# Altium project Ambilight.PrjPcb
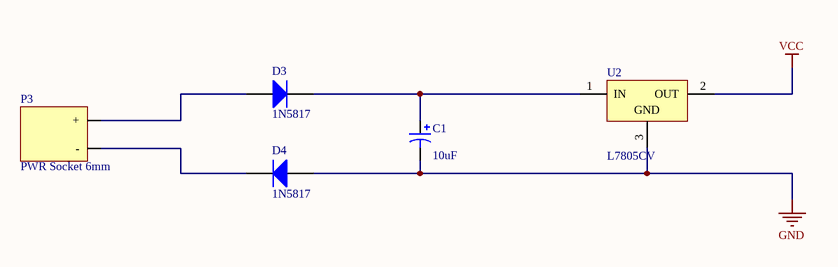
[diagram p0: Power.SchDoc]
7 sheets, 56 parts. Net scope: flat (ports and power ports of the same name join across sheets).
Board files: Interface Board.PcbDoc, LED Control Board.PcbDoc
Sheets:
  Power.SchDoc
  Reset.SchDoc
  USB Circuit.SchDoc
  LED Circuit.SchDoc
  LED Control A0-A3.SchDoc
  LED Control A4-A7.SchDoc
  LED Connectors.SchDoc

## Sheet Power.SchDoc
size A4

### Parts
C1  value 10uF  [CAPPR1.5-4x5]  (hidden comment: Cap Pol1)
D3  1N5817  [1N5817]
D4  1N5817  [1N5817]
P3  PWR Socket 6mm  [PWR Socket 6mm]
U2  L7805CV  [TO220ABN]

### Nets
GND: C1.2 D4.A U2.3(GND)
VCC: U2.2(OUT)
NetC1_1: C1.1 D3.K U2.1(IN)
NetD3_A: D3.A P3.+
NetD4_K: D4.K P3.-

### Library data of the parts
C1 = Cap Pol1: Polarized Capacitor (Radial); Published: 8-Jun-2000; LatestRevisionDate: 17-Jul-2002; LatestRevisionNote: Re-released for DXP Platform.; PackageReference: RB7.6-15; Publisher: Altium Limited
U2 = L7805CV: Positive Voltage Regulator; Note: Tab is connected to pin 3 (GND).; Published: 24-Aug-2001; LatestRevisionDate: 17-Jul-2002; LatestRevisionNote: Re-released for DXP Platform.; DatasheetVersion: Dec-1998; PackageVersion: Jun-1998; PackageReference: TO220ABN; Publisher: Altium Limited; PackageDescription: TO, Thru-Hole, Vertical, Heatsink Mounted; 3 In-Line Leads; Pitch 2.54 mm; Pin sequence 1, 3, 2; ComponentLink1Description: Manufacturer Link; ComponentLink1URL: http://www.st.com/

## Sheet Reset.SchDoc
size A4
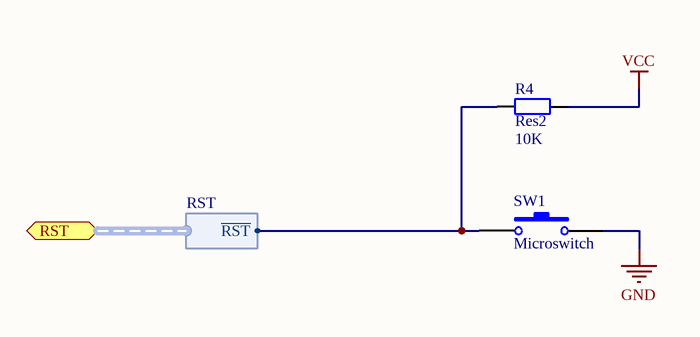
[diagram p1: Reset.SchDoc]

### Parts
R4  Res2  value 10K  [AXIAL-0.4]
SW1  Microswitch  [DIP Microswitch 6x6mm]

### Ports
RST (harness RST)

### Harnesses
RST: ~{RST}

### Nets
GND: SW1.2
VCC: R4.2
NetP4_2: R4.1 SW1.1 ; port RST.~{RST}

### Library data of the parts
R4 = Res2: Resistor; Published: 8-Jun-2000; LatestRevisionDate: 17-Jul-2002; LatestRevisionNote: Re-released for DXP Platform.; PackageReference: AXIAL-0.4; Publisher: Altium Limited

## Sheet USB Circuit.SchDoc
size A4
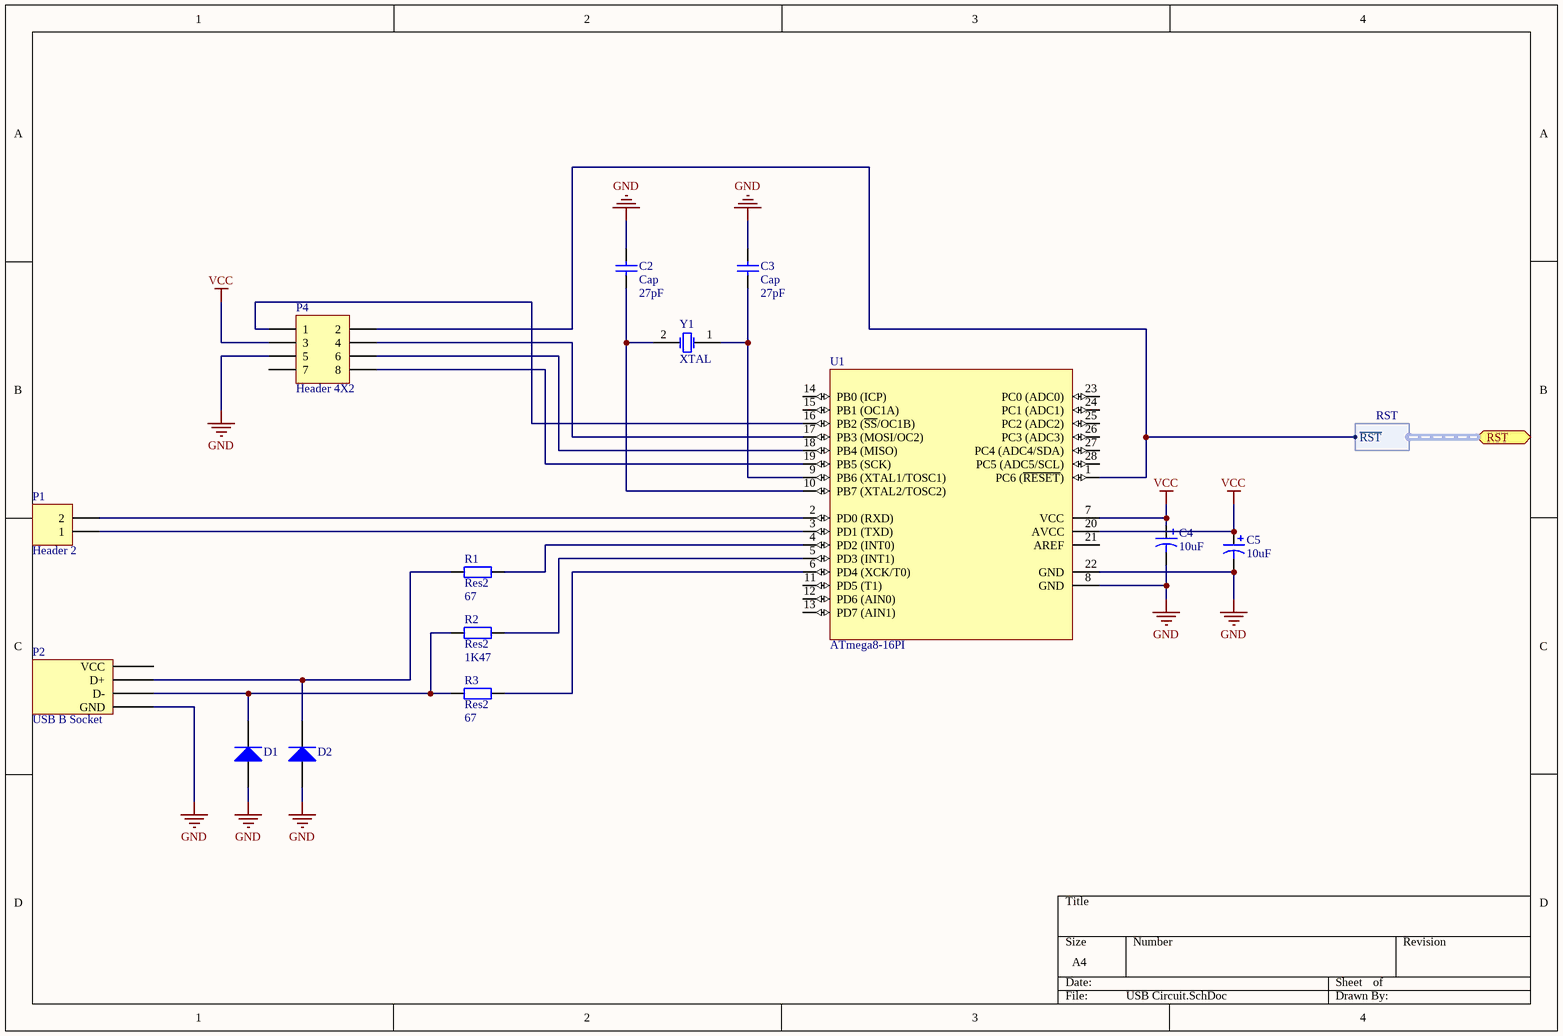
[diagram p2: USB Circuit.SchDoc]

### Parts
C2  Cap  value 27pF  [CAPR2.54-5.1x3.2]
C3  Cap  value 27pF  [CAPR2.54-5.1x3.2]
C4  value 10uF  [CAPPR1.5-4x5]  (hidden comment: Cap Pol1)
C5  value 10uF  [CAPPR1.5-4x5]  (hidden comment: Cap Pol1)
D1  BZX79-C3V6  [SOD27]  (value not drawn)
D2  BZX79-C3V6  [SOD27]  (value not drawn)
P1  Header 2  [HDR1X2]
P2  USB B Socket  [USB B Socket]
P4  Header 4X2  [HDR2X4]
R1  Res2  value 67  [AXIAL-0.4]
R2  Res2  value 1K47  [AXIAL-0.4]
R3  Res2  value 67  [AXIAL-0.4]
U1  ATmega8-16PI  [28P3]
Y1  XTAL  [Crystal Oscillator]

### Ports
RST (harness RST)

### Harnesses
RST: ~{RST}

### Nets
GND: C2.2 C3.2 C4.2 C5.2 D1.1(A) D2.1(A) P2.GND P4.5 U1.8(GND) U1.22(GND)
VCC: C4.1 C5.1 P4.3 U1.7(VCC) U1.20(AVCC)
NetC2_1: C2.1 U1.10(PB7_(XTAL2/TOSC2)) Y1.2(OSC2)
NetC3_1: C3.1 U1.9(PB6_(XTAL1/TOSC1)) Y1.1(OSC1)
NetD1_2: D1.2(K) P2.D- R2.2 R3.1
NetD2_2: D2.2(K) P2.D+ R1.1
NetP1_1: P1.1 U1.3(PD1_(TXD))
NetP1_2: P1.2 U1.2(PD0_(RXD))
NetP4_1: P4.1 U1.16(PB2_(~{SS}/OC1B))
NetP4_2: P4.2 U1.1(PC6_(~{RESET})) ; port RST.~{RST}
NetP4_4: P4.4 U1.17(PB3_(MOSI/OC2))
NetP4_6: P4.6 U1.18(PB4_(MISO))
NetP4_8: P4.8 U1.19(PB5_(SCK))
NetR1_2: R1.2 U1.4(PD2_(INT0))
NetR2_1: R2.1 U1.5(PD3_(INT1))
NetR3_2: R3.2 U1.6(PD4_(XCK/T0))

Not connected (* = marked no-connect by the designer): P2 VCC; P4 7; U1 11(PD5_(T1)) 12(PD6_(AIN0)) 13(PD7_(AIN1)) 14(PB0_(ICP)) 15(PB1_(OC1A)) 21(AREF) 23(PC0_(ADC0)) 24(PC1_(ADC1)) 25(PC2_(ADC2)) 26(PC3_(ADC3)) 27(PC4_(ADC4/SDA)) 28(PC5_(ADC5/SCL))

### Library data of the parts
C2 C3 = Cap: Capacitor; Published: 8-Jun-2000; LatestRevisionDate: 17-Jul-2002; LatestRevisionNote: Re-released for DXP Platform.; PackageReference: RAD-0.3; Publisher: Altium Limited
C4 C5 = Cap Pol1: Polarized Capacitor (Radial); Published: 8-Jun-2000; LatestRevisionDate: 17-Jul-2002; LatestRevisionNote: Re-released for DXP Platform.; PackageReference: RB7.6-15; Publisher: Altium Limited
D1 D2 = BZX79-C3V6: Voltage Regulator Diode; Code_IEC: A24; Published: 17-Sep-2003; DatasheetVersion: 27-Feb-2002; PackageVersion: Apr-1999; PackageReference: SOD27; Publisher: Altium Limited; PackageDescription: Diode, Axial; Body 4.3 x 1.9 mm (LxDia. max), Lead Dia. 0.56 mm (max); Code_JEITA: SC-40; Code_JEDEC: DO-35; ComponentLink1Description: Manufacturer Link; ComponentLink1URL: http://www.semiconductors.philips.com/; ComponentLink2Description: Datasheet; ComponentLink2URL: http://www.semiconductors.philips.com/acrobat/datasheets/BZX79_3.pdf
P1 = Header 2: Header, 2-Pin; LatestRevisionDate: 17-Jul-2002; LatestRevisionNote: Re-released for DXP Platform.; Publisher: Altium Limited
P4 = Header 4X2: Header, 4-Pin, Dual row; LatestRevisionDate: 17-Jul-2002; LatestRevisionNote: Re-released for DXP Platform.; Publisher: Altium Limited
R1-R3 = Res2: Resistor; Published: 8-Jun-2000; LatestRevisionDate: 17-Jul-2002; LatestRevisionNote: Re-released for DXP Platform.; PackageReference: AXIAL-0.4; Publisher: Altium Limited
U1 = ATmega8-16PI: 8-Bit AVR Microcontroller with 8K Bytes of In-System Programmable Flash Memory; Published: 17-Sep-2003; LatestRevisionDate: 04-Mar-2005; LatestRevisionNote: Stylized 3D Model Added.; DatasheetVersion: 2486H-AVR-09/02; PackageVersion: revB, Sep-2001; PackageReference: 28P3; Publisher: Altium Limited; PackageDescription: DIP; 28 Leads; Row Spacing 7.62 mm; Pitch 2.54 mm; ComponentLink1Description: Manufacturer Link; ComponentLink1URL: http://www.atmel.com; ComponentLink2Description: Datasheet; ComponentLink2URL: http://www.atmel.com/dyn/resources/prod_documents/doc2486.pdf
Y1 = Crystal Oscillator

## Sheet LED Circuit.SchDoc
size A4
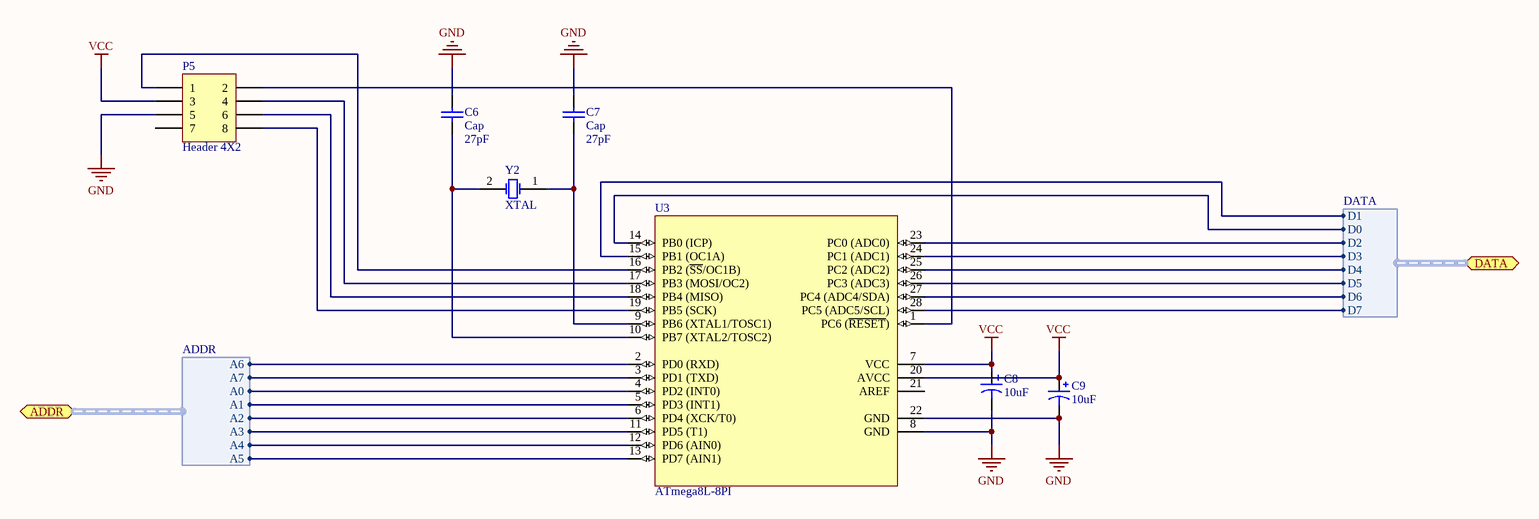
[diagram p3: LED Circuit.SchDoc]

### Parts
C6  Cap  value 27pF  [CAPR2.54-5.1x3.2]
C7  Cap  value 27pF  [CAPR2.54-5.1x3.2]
C8  value 10uF  [CAPPR1.5-4x5]  (hidden comment: Cap Pol1)
C9  value 10uF  [CAPPR1.5-4x5]  (hidden comment: Cap Pol1)
P5  Header 4X2  [HDR2X4]
U3  ATmega8L-8PI  [28P3]
Y2  XTAL  [Crystal Oscillator]

### Ports
ADDR (harness ADDR), DATA (harness DATA)

### Harnesses
ADDR: A6, A7, A0, A1, A2, A3, A4, A5
DATA: D1, D0, D2, D3, D4, D5, D6, D7

### Nets
GND: C6.2 C7.2 C8.2 C9.2 P5.5 U3.8(GND) U3.22(GND)
VCC: C8.1 C9.1 P5.3 U3.7(VCC) U3.20(AVCC)
NetC6_1: C6.1 U3.10(PB7_(XTAL2/TOSC2)) Y2.2(OSC2)
NetC7_1: C7.1 U3.9(PB6_(XTAL1/TOSC1)) Y2.1(OSC1)
NetP5_1: P5.1 U3.16(PB2_(~{SS}/OC1B))
NetP5_2: P5.2 U3.1(PC6_(~{RESET}))
NetP5_4: P5.4 U3.17(PB3_(MOSI/OC2))
NetP5_6: P5.6 U3.18(PB4_(MISO))
NetP5_8: P5.8 U3.19(PB5_(SCK))
NetU3_2: U3.2(PD0_(RXD)) ; port ADDR.A6
NetU3_3: U3.3(PD1_(TXD)) ; port ADDR.A7
NetU3_4: U3.4(PD2_(INT0)) ; port ADDR.A0
NetU3_5: U3.5(PD3_(INT1)) ; port ADDR.A1
NetU3_6: U3.6(PD4_(XCK/T0)) ; port ADDR.A2
NetU3_11: U3.11(PD5_(T1)) ; port ADDR.A3
NetU3_12: U3.12(PD6_(AIN0)) ; port ADDR.A4
NetU3_13: U3.13(PD7_(AIN1)) ; port ADDR.A5
NetU3_14: U3.14(PB0_(ICP)) ; port DATA.D0
NetU3_15: U3.15(PB1_(OC1A)) ; port DATA.D1
NetU3_23: U3.23(PC0_(ADC0)) ; port DATA.D2
NetU3_24: U3.24(PC1_(ADC1)) ; port DATA.D3
NetU3_25: U3.25(PC2_(ADC2)) ; port DATA.D4
NetU3_26: U3.26(PC3_(ADC3)) ; port DATA.D5
NetU3_27: U3.27(PC4_(ADC4/SDA)) ; port DATA.D6
NetU3_28: U3.28(PC5_(ADC5/SCL)) ; port DATA.D7

Not connected (* = marked no-connect by the designer): P5 7; U3 21(AREF)

### Library data of the parts
C6 C7 = Cap: Capacitor; Published: 8-Jun-2000; LatestRevisionDate: 17-Jul-2002; LatestRevisionNote: Re-released for DXP Platform.; PackageReference: RAD-0.3; Publisher: Altium Limited
C8 C9 = Cap Pol1: Polarized Capacitor (Radial); Published: 8-Jun-2000; LatestRevisionDate: 17-Jul-2002; LatestRevisionNote: Re-released for DXP Platform.; PackageReference: RB7.6-15; Publisher: Altium Limited
P5 = Header 4X2: Header, 4-Pin, Dual row; LatestRevisionDate: 17-Jul-2002; LatestRevisionNote: Re-released for DXP Platform.; Publisher: Altium Limited
U3 = ATmega8L-8PI: 8-Bit AVR Microcontroller with 8K Bytes of In-System Programmable Flash Memory; Published: 17-Sep-2003; LatestRevisionDate: 04-Mar-2005; LatestRevisionNote: Stylized 3D Model Added.; DatasheetVersion: 2486H-AVR-09/02; PackageVersion: revB, Sep-2001; PackageReference: 28P3; Publisher: Altium Limited; PackageDescription: DIP; 28 Leads; Row Spacing 7.62 mm; Pitch 2.54 mm; ComponentLink1Description: Manufacturer Link; ComponentLink1URL: http://www.atmel.com; ComponentLink2Description: Datasheet; ComponentLink2URL: http://www.atmel.com/dyn/resources/prod_documents/doc2486.pdf
Y2 = Crystal Oscillator

## Sheet LED Control A0-A3.SchDoc
size A4; Author: Karol Maciaszek
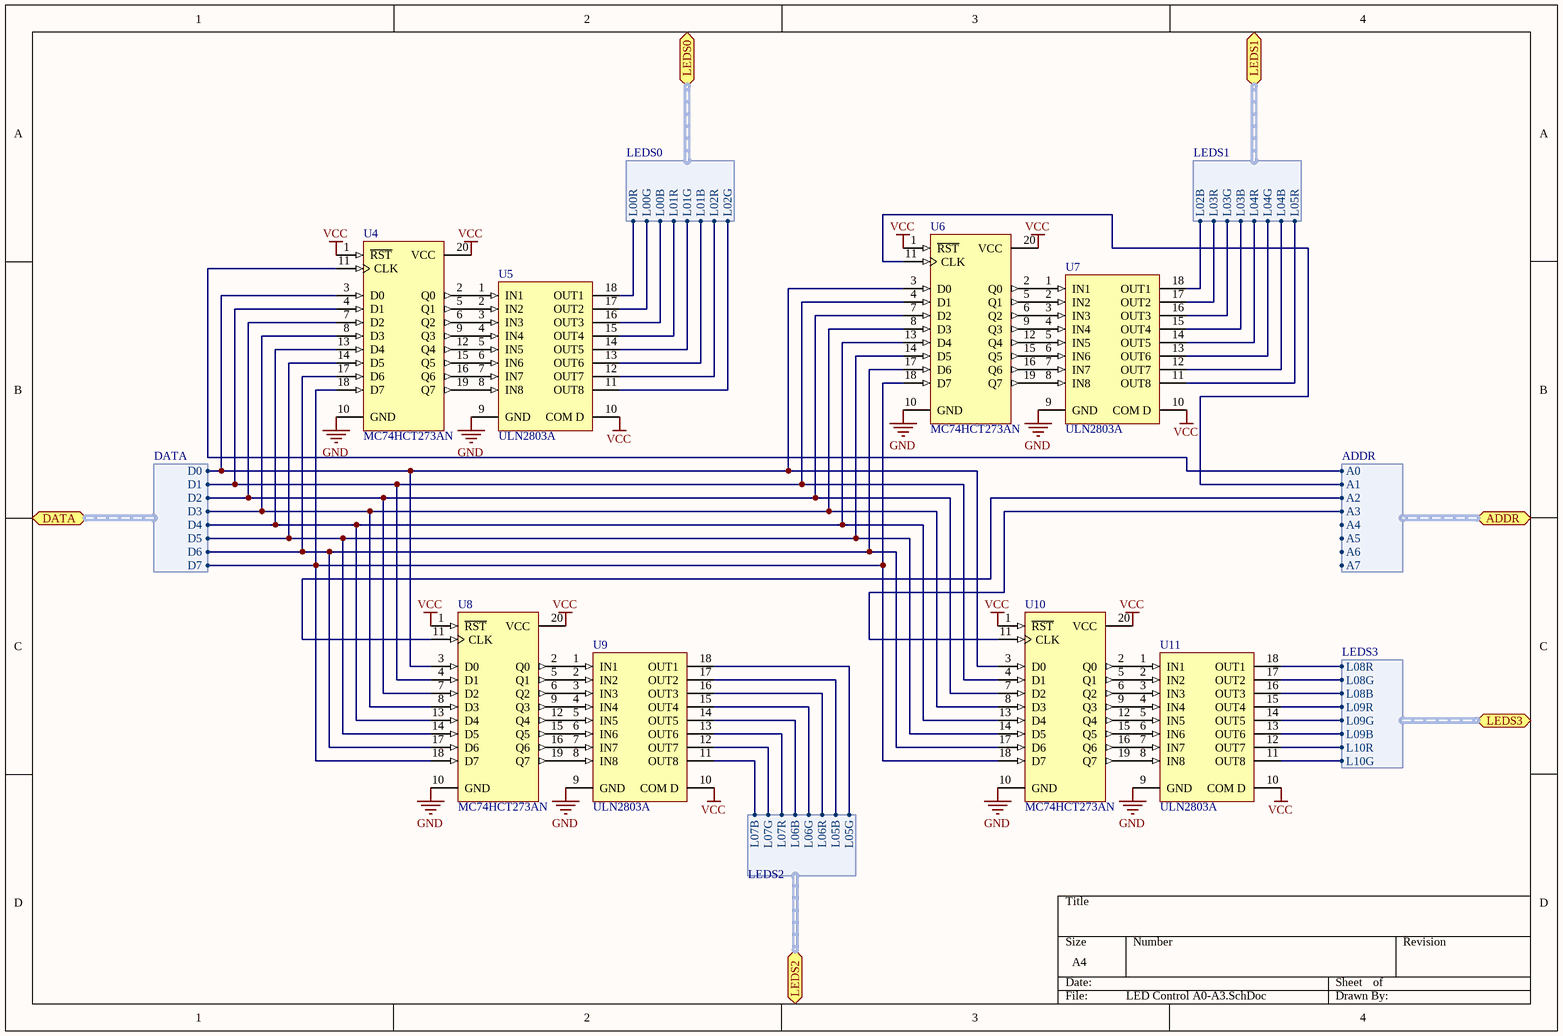
[diagram p4: LED Control A0-A3.SchDoc]

### Parts
U4  MC74HCT273AN  [738-03]
U5  ULN2803A  [DIP18]
U6  MC74HCT273AN  [738-03]
U7  ULN2803A  [DIP18]
U8  MC74HCT273AN  [738-03]
U9  ULN2803A  [DIP18]
U10  MC74HCT273AN  [738-03]
U11  ULN2803A  [DIP18]

### Ports
ADDR (harness ADDR), DATA (harness DATA), LEDS0 (harness LEDS0), LEDS1 (harness LEDS1), LEDS2 (harness LEDS2), LEDS3 (harness LEDS3)

### Harnesses
DATA: D7, D6, D5, D4, D3, D2, D1, D0
ADDR: A7, A6, A5, A4, A3, A2, A1, A0
LEDS0: L00R, L00G, L00B, L01R, L01G, L01B, L02R, L02G
LEDS1: L02B, L03R, L03G, L03B, L04R, L04G, L04B, L05R
LEDS2: L05G, L05B, L06R, L06G, L06B, L07R, L07G, L07B
LEDS3: L08R, L08G, L08B, L09R, L09G, L09B, L10R, L10G

### Nets
GND: U4.10(GND) U5.9(GND) U6.10(GND) U7.9(GND) U8.10(GND) U9.9(GND) U10.10(GND) U11.9(GND)
VCC: U4.1(~{RST}) U4.20(VCC) U5.10(COM_D) U6.1(~{RST}) U6.20(VCC) U7.10(COM_D) U8.1(~{RST}) U8.20(VCC) U9.10(COM_D) U10.1(~{RST}) U10.20(VCC) U11.10(COM_D)
NetPL00_1: U5.18(OUT1) ; port LEDS0.L00R
NetPL00_2: U5.17(OUT2) ; port LEDS0.L00G
NetPL00_3: U5.16(OUT3) ; port LEDS0.L00B
NetPL01_1: U5.15(OUT4) ; port LEDS0.L01R
NetPL01_2: U5.14(OUT5) ; port LEDS0.L01G
NetPL01_3: U5.13(OUT6) ; port LEDS0.L01B
NetPL02_1: U5.12(OUT7) ; port LEDS0.L02R
NetPL02_2: U5.11(OUT8) ; port LEDS0.L02G
NetPL02_3: U7.18(OUT1) ; port LEDS1.L02B
NetPL03_1: U7.16(OUT3) ; port LEDS1.L03G
NetPL03_2: U7.17(OUT2) ; port LEDS1.L03R
NetPL03_3: U7.15(OUT4) ; port LEDS1.L03B
NetPL04_1: U7.14(OUT5) ; port LEDS1.L04R
NetPL04_2: U7.13(OUT6) ; port LEDS1.L04G
NetPL04_3: U7.12(OUT7) ; port LEDS1.L04B
NetPL05_1: U7.11(OUT8) ; port LEDS1.L05R
NetPL05_2: U9.18(OUT1) ; port LEDS2.L05G
NetPL05_3: U9.17(OUT2) ; port LEDS2.L05B
NetPL06_1: U9.16(OUT3) ; port LEDS2.L06R
NetPL06_2: U9.15(OUT4) ; port LEDS2.L06G
NetPL06_3: U9.14(OUT5) ; port LEDS2.L06B
NetPL07_1: U9.13(OUT6) ; port LEDS2.L07R
NetPL07_2: U9.12(OUT7) ; port LEDS2.L07G
NetPL07_3: U9.11(OUT8) ; port LEDS2.L07B
NetPL08_1: U11.18(OUT1) ; port LEDS3.L08R
NetPL08_2: U11.17(OUT2) ; port LEDS3.L08G
NetPL08_3: U11.16(OUT3) ; port LEDS3.L08B
NetPL09_1: U11.15(OUT4) ; port LEDS3.L09R
NetPL09_2: U11.14(OUT5) ; port LEDS3.L09G
NetPL09_3: U11.13(OUT6) ; port LEDS3.L09B
NetPL10_1: U11.12(OUT7) ; port LEDS3.L10R
NetPL10_2: U11.11(OUT8) ; port LEDS3.L10G
NetU3_4: U4.11(CLK) ; port ADDR.A0
NetU3_5: U6.11(CLK) ; port ADDR.A1
NetU3_6: U8.11(CLK) ; port ADDR.A2
NetU3_11: U10.11(CLK) ; port ADDR.A3
NetU3_14: U4.3(D0) U6.3(D0) U8.3(D0) U10.3(D0) ; port DATA.D0
NetU3_15: U4.4(D1) U6.4(D1) U8.4(D1) U10.4(D1) ; port DATA.D1
NetU3_23: U4.7(D2) U6.7(D2) U8.7(D2) U10.7(D2) ; port DATA.D2
NetU3_24: U4.8(D3) U6.8(D3) U8.8(D3) U10.8(D3) ; port DATA.D3
NetU3_25: U4.13(D4) U6.13(D4) U8.13(D4) U10.13(D4) ; port DATA.D4
NetU3_26: U4.14(D5) U6.14(D5) U8.14(D5) U10.14(D5) ; port DATA.D5
NetU3_27: U4.17(D6) U6.17(D6) U8.17(D6) U10.17(D6) ; port DATA.D6
NetU3_28: U4.18(D7) U6.18(D7) U8.18(D7) U10.18(D7) ; port DATA.D7
NetU4_2: U4.2(Q0) U5.1(IN1)
NetU4_5: U4.5(Q1) U5.2(IN2)
NetU4_6: U4.6(Q2) U5.3(IN3)
NetU4_9: U4.9(Q3) U5.4(IN4)
NetU4_12: U4.12(Q4) U5.5(IN5)
NetU4_15: U4.15(Q5) U5.6(IN6)
NetU4_16: U4.16(Q6) U5.7(IN7)
NetU4_19: U4.19(Q7) U5.8(IN8)
NetU6_2: U6.2(Q0) U7.1(IN1)
NetU6_5: U6.5(Q1) U7.2(IN2)
NetU6_6: U6.6(Q2) U7.3(IN3)
NetU6_9: U6.9(Q3) U7.4(IN4)
NetU6_12: U6.12(Q4) U7.5(IN5)
NetU6_15: U6.15(Q5) U7.6(IN6)
NetU6_16: U6.16(Q6) U7.7(IN7)
NetU6_19: U6.19(Q7) U7.8(IN8)
NetU8_2: U8.2(Q0) U9.1(IN1)
NetU8_5: U8.5(Q1) U9.2(IN2)
NetU8_6: U8.6(Q2) U9.3(IN3)
NetU8_9: U8.9(Q3) U9.4(IN4)
NetU8_12: U8.12(Q4) U9.5(IN5)
NetU8_15: U8.15(Q5) U9.6(IN6)
NetU8_16: U8.16(Q6) U9.7(IN7)
NetU8_19: U8.19(Q7) U9.8(IN8)
NetU10_2: U10.2(Q0) U11.1(IN1)
NetU10_5: U10.5(Q1) U11.2(IN2)
NetU10_6: U10.6(Q2) U11.3(IN3)
NetU10_9: U10.9(Q3) U11.4(IN4)
NetU10_12: U10.12(Q4) U11.5(IN5)
NetU10_15: U10.15(Q5) U11.6(IN6)
NetU10_16: U10.16(Q6) U11.7(IN7)
NetU10_19: U10.19(Q7) U11.8(IN8)

### Library data of the parts
U4 U6 U8 U10 = MC74HCT273AN: Octal D-Type Flip-Flop with Common Clock and Reset with LSTTL-Compatible Inputs; Published: 15-Apr-2002; DatasheetVersion: Mar-2000; PackageVersion: 1996; PackageReference: 738-03; Publisher: Altium Limited; PackageDescription: DIP; 20 Leads; Row Spacing 7.62 mm; Pitch 2.54 mm; Code_JEDEC: MS-001-AD; ComponentLink1Description: Manufacturer Link; ComponentLink1URL: http://www.onsemi.com/; ComponentLink2Description: Datasheet; ComponentLink2URL: http://www.onsemi.com/pub/Collateral/MC74HCT273A-D.PDF
U5 U7 U9 U11 = ULN2803A: Eight Darlington Array; Published: 8-Jun-2000; LatestRevisionDate: 06-Jun-2005; LatestRevisionNote: Stylized 3D Model Added.; DatasheetVersion: Sep-1997; PackageReference: DIP18; Publisher: Altium Limited; PackageDescription: DIP; 18 Leads; Row Spacing 7.62 mm; Pitch 2.54 mm; ComponentLink1Description: Manufacturer Link; ComponentLink1URL: http://www.st.com/; ComponentLink2Description: Datasheet; ComponentLink2URL: http://www.st.com/stonline/products/literature/ds/1536/uln2801a.pdf

## Sheet LED Control A4-A7.SchDoc
size A4
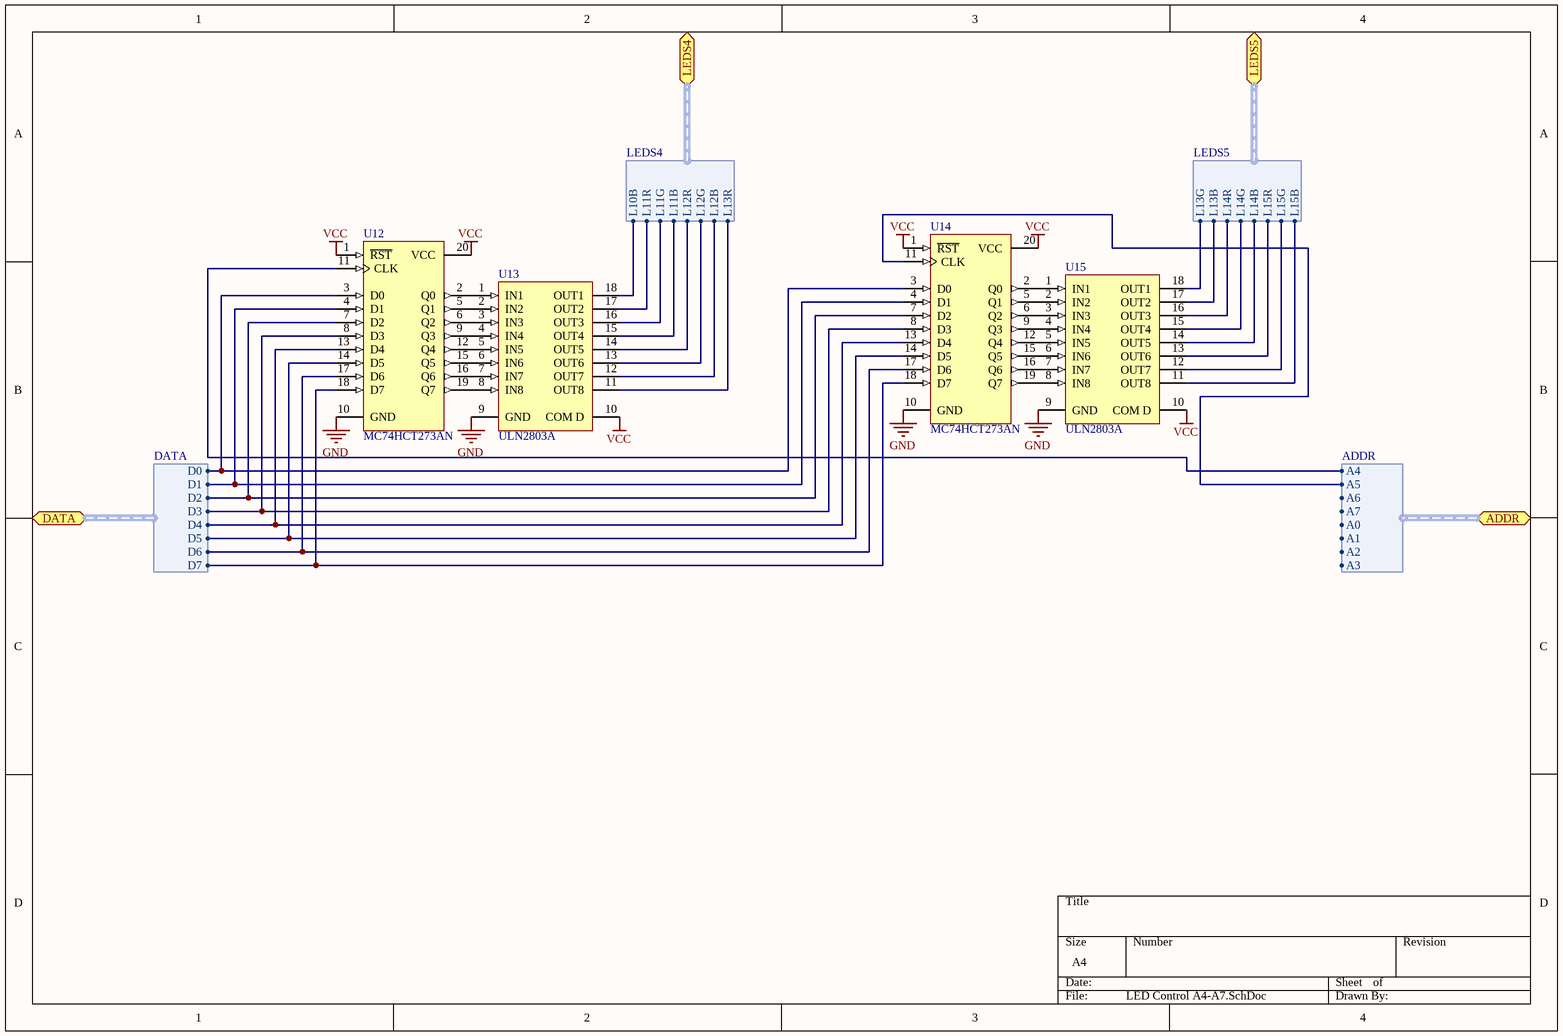
[diagram p5: LED Control A4-A7.SchDoc]

### Parts
U12  MC74HCT273AN  [738-03]
U13  ULN2803A  [DIP18]
U14  MC74HCT273AN  [738-03]
U15  ULN2803A  [DIP18]

### Ports
ADDR (harness ADDR), DATA (harness DATA), LEDS4 (harness LEDS4), LEDS5 (harness LEDS5)

### Harnesses
DATA: D7, D6, D5, D4, D3, D2, D1, D0
LEDS4: L10B, L11R, L11G, L11B, L12R, L12G, L12B, L13R
LEDS5: L13G, L13B, L14R, L14G, L14B, L15R, L15G, L15B
ADDR: A7, A6, A5, A4, A0, A1, A2, A3

### Nets
GND: U12.10(GND) U13.9(GND) U14.10(GND) U15.9(GND)
VCC: U12.1(~{RST}) U12.20(VCC) U13.10(COM_D) U14.1(~{RST}) U14.20(VCC) U15.10(COM_D)
NetPL10_3: U13.18(OUT1) ; port LEDS4.L10B
NetPL11_1: U13.16(OUT3) ; port LEDS4.L11G
NetPL11_2: U13.17(OUT2) ; port LEDS4.L11R
NetPL11_3: U13.15(OUT4) ; port LEDS4.L11B
NetPL12_1: U13.14(OUT5) ; port LEDS4.L12R
NetPL12_2: U13.13(OUT6) ; port LEDS4.L12G
NetPL12_3: U13.12(OUT7) ; port LEDS4.L12B
NetPL13_1: U13.11(OUT8) ; port LEDS4.L13R
NetPL13_2: U15.18(OUT1) ; port LEDS5.L13G
NetPL13_3: U15.17(OUT2) ; port LEDS5.L13B
NetPL14_1: U15.16(OUT3) ; port LEDS5.L14R
NetPL14_2: U15.15(OUT4) ; port LEDS5.L14G
NetPL14_3: U15.14(OUT5) ; port LEDS5.L14B
NetPL15_1: U15.13(OUT6) ; port LEDS5.L15R
NetPL15_2: U15.12(OUT7) ; port LEDS5.L15G
NetPL15_3: U15.11(OUT8) ; port LEDS5.L15B
NetU3_12: U12.11(CLK) ; port ADDR.A4
NetU3_13: U14.11(CLK) ; port ADDR.A5
NetU3_14: U12.3(D0) U14.3(D0) ; port DATA.D0
NetU3_15: U12.4(D1) U14.4(D1) ; port DATA.D1
NetU3_23: U12.7(D2) U14.7(D2) ; port DATA.D2
NetU3_24: U12.8(D3) U14.8(D3) ; port DATA.D3
NetU3_25: U12.13(D4) U14.13(D4) ; port DATA.D4
NetU3_26: U12.14(D5) U14.14(D5) ; port DATA.D5
NetU3_27: U12.17(D6) U14.17(D6) ; port DATA.D6
NetU3_28: U12.18(D7) U14.18(D7) ; port DATA.D7
NetU12_2: U12.2(Q0) U13.1(IN1)
NetU12_5: U12.5(Q1) U13.2(IN2)
NetU12_6: U12.6(Q2) U13.3(IN3)
NetU12_9: U12.9(Q3) U13.4(IN4)
NetU12_12: U12.12(Q4) U13.5(IN5)
NetU12_15: U12.15(Q5) U13.6(IN6)
NetU12_16: U12.16(Q6) U13.7(IN7)
NetU12_19: U12.19(Q7) U13.8(IN8)
NetU14_2: U14.2(Q0) U15.1(IN1)
NetU14_5: U14.5(Q1) U15.2(IN2)
NetU14_6: U14.6(Q2) U15.3(IN3)
NetU14_9: U14.9(Q3) U15.4(IN4)
NetU14_12: U14.12(Q4) U15.5(IN5)
NetU14_15: U14.15(Q5) U15.6(IN6)
NetU14_16: U14.16(Q6) U15.7(IN7)
NetU14_19: U14.19(Q7) U15.8(IN8)

### Library data of the parts
U12 U14 = MC74HCT273AN: as U4 on sheet LED Control A0-A3; Published: 15-Apr-2002; DatasheetVersion: Mar-2000; PackageVersion: 1996; PackageReference: 738-03; Publisher: Altium Limited; PackageDescription: DIP; 20 Leads; Row Spacing 7.62 mm; Pitch 2.54 mm; Code_JEDEC: MS-001-AD; ComponentLink1Description: Manufacturer Link; ComponentLink1URL: http://www.onsemi.com/; ComponentLink2Description: Datasheet; ComponentLink2URL: http://www.onsemi.com/pub/Collateral/MC74HCT273A-D.PDF
U13 U15 = ULN2803A: Eight Darlington Array; Published: 8-Jun-2000; LatestRevisionDate: 06-Jun-2005; LatestRevisionNote: Stylized 3D Model Added.; DatasheetVersion: Sep-1997; PackageReference: DIP18; Publisher: Altium Limited; PackageDescription: DIP; 18 Leads; Row Spacing 7.62 mm; Pitch 2.54 mm; ComponentLink1Description: Manufacturer Link; ComponentLink1URL: http://www.st.com/; ComponentLink2Description: Datasheet; ComponentLink2URL: http://www.st.com/stonline/products/literature/ds/1536/uln2801a.pdf

## Sheet LED Connectors.SchDoc
size A4
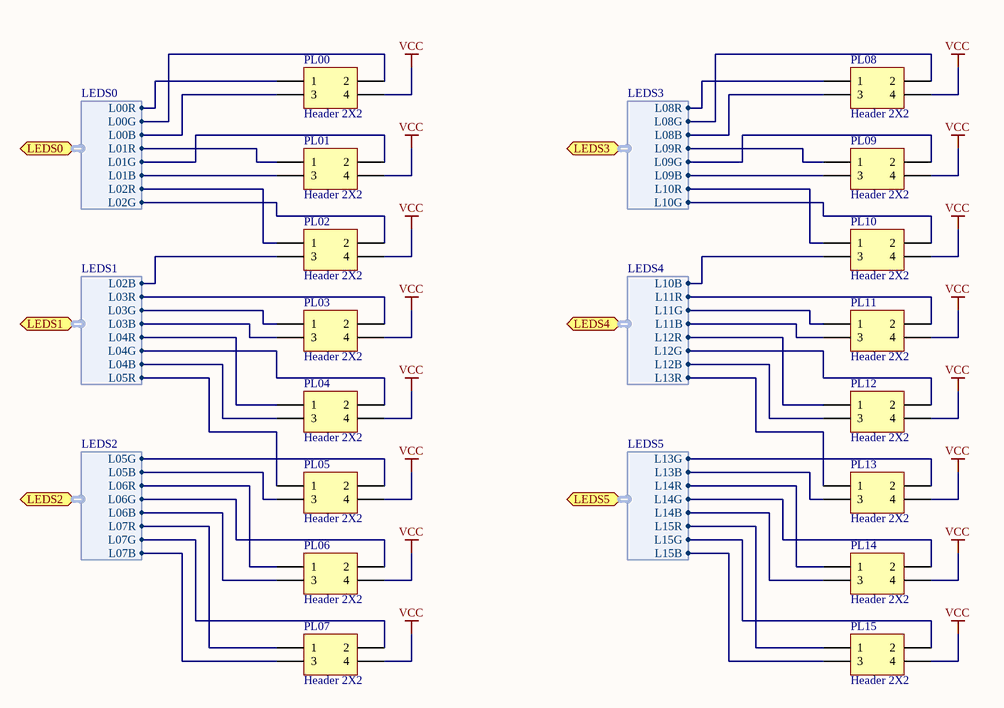
[diagram p6: LED Connectors.SchDoc]

### Parts
PL00  Header 2X2  [HDR2X2]
PL01  Header 2X2  [HDR2X2]
PL02  Header 2X2  [HDR2X2]
PL03  Header 2X2  [HDR2X2]
PL04  Header 2X2  [HDR2X2]
PL05  Header 2X2  [HDR2X2]
PL06  Header 2X2  [HDR2X2]
PL07  Header 2X2  [HDR2X2]
PL08  Header 2X2  [HDR2X2]
PL09  Header 2X2  [HDR2X2]
PL10  Header 2X2  [HDR2X2]
PL11  Header 2X2  [HDR2X2]
PL12  Header 2X2  [HDR2X2]
PL13  Header 2X2  [HDR2X2]
PL14  Header 2X2  [HDR2X2]
PL15  Header 2X2  [HDR2X2]

### Ports
LEDS0 (harness LEDS0), LEDS1 (harness LEDS1), LEDS2 (harness LEDS2), LEDS3 (harness LEDS3), LEDS4 (harness LEDS4), LEDS5 (harness LEDS5)

### Harnesses
LEDS0: L02G, L02R, L01B, L01G, L01R, L00B, L00G, L00R
LEDS1: L05R, L04B, L04G, L04R, L03B, L03G, L03R, L02B
LEDS2: L07B, L07G, L07R, L06B, L06G, L06R, L05B, L05G
LEDS3: L10G, L10R, L09B, L09G, L09R, L08B, L08G, L08R
LEDS4: L13R, L12B, L12G, L12R, L11B, L11G, L11R, L10B
LEDS5: L15B, L15G, L15R, L14B, L14G, L14R, L13B, L13G

### Nets
VCC: PL00.4 PL01.4 PL02.4 PL03.4 PL04.4 PL05.4 PL06.4 PL07.4 PL08.4 PL09.4 PL10.4 PL11.4 PL12.4 PL13.4 PL14.4 PL15.4
NetPL00_1: PL00.1 ; port LEDS0.L00R
NetPL00_2: PL00.2 ; port LEDS0.L00G
NetPL00_3: PL00.3 ; port LEDS0.L00B
NetPL01_1: PL01.1 ; port LEDS0.L01R
NetPL01_2: PL01.2 ; port LEDS0.L01G
NetPL01_3: PL01.3 ; port LEDS0.L01B
NetPL02_1: PL02.1 ; port LEDS0.L02R
NetPL02_2: PL02.2 ; port LEDS0.L02G
NetPL02_3: PL02.3 ; port LEDS1.L02B
NetPL03_1: PL03.1 ; port LEDS1.L03G
NetPL03_2: PL03.2 ; port LEDS1.L03R
NetPL03_3: PL03.3 ; port LEDS1.L03B
NetPL04_1: PL04.1 ; port LEDS1.L04R
NetPL04_2: PL04.2 ; port LEDS1.L04G
NetPL04_3: PL04.3 ; port LEDS1.L04B
NetPL05_1: PL05.1 ; port LEDS1.L05R
NetPL05_2: PL05.2 ; port LEDS2.L05G
NetPL05_3: PL05.3 ; port LEDS2.L05B
NetPL06_1: PL06.1 ; port LEDS2.L06R
NetPL06_2: PL06.2 ; port LEDS2.L06G
NetPL06_3: PL06.3 ; port LEDS2.L06B
NetPL07_1: PL07.1 ; port LEDS2.L07R
NetPL07_2: PL07.2 ; port LEDS2.L07G
NetPL07_3: PL07.3 ; port LEDS2.L07B
NetPL08_1: PL08.1 ; port LEDS3.L08R
NetPL08_2: PL08.2 ; port LEDS3.L08G
NetPL08_3: PL08.3 ; port LEDS3.L08B
NetPL09_1: PL09.1 ; port LEDS3.L09R
NetPL09_2: PL09.2 ; port LEDS3.L09G
NetPL09_3: PL09.3 ; port LEDS3.L09B
NetPL10_1: PL10.1 ; port LEDS3.L10R
NetPL10_2: PL10.2 ; port LEDS3.L10G
NetPL10_3: PL10.3 ; port LEDS4.L10B
NetPL11_1: PL11.1 ; port LEDS4.L11G
NetPL11_2: PL11.2 ; port LEDS4.L11R
NetPL11_3: PL11.3 ; port LEDS4.L11B
NetPL12_1: PL12.1 ; port LEDS4.L12R
NetPL12_2: PL12.2 ; port LEDS4.L12G
NetPL12_3: PL12.3 ; port LEDS4.L12B
NetPL13_1: PL13.1 ; port LEDS4.L13R
NetPL13_2: PL13.2 ; port LEDS5.L13G
NetPL13_3: PL13.3 ; port LEDS5.L13B
NetPL14_1: PL14.1 ; port LEDS5.L14R
NetPL14_2: PL14.2 ; port LEDS5.L14G
NetPL14_3: PL14.3 ; port LEDS5.L14B
NetPL15_1: PL15.1 ; port LEDS5.L15R
NetPL15_2: PL15.2 ; port LEDS5.L15G
NetPL15_3: PL15.3 ; port LEDS5.L15B

### Library data of the parts
PL00 PL01 PL02 PL03 PL04 PL05 PL06 PL07 PL08 PL09-PL15 = Header 2X2: Header, 2-Pin, Dual row; LatestRevisionDate: 17-Jul-2002; LatestRevisionNote: Re-released for DXP Platform.; Publisher: Altium Limited

## Nets that join several sheets
GND: Power (C1.2 D4.A U2.3), Reset (SW1.2), USB Circuit (10 pins), LED Circuit (7 pins), LED Control A0-A3 (8 pins), LED Control A4-A7 (U12.10 U13.9 U14.10 U15.9)
VCC: Power (U2.2), Reset (R4.2), USB Circuit (5 pins), LED Circuit (5 pins), LED Control A0-A3 (12 pins), LED Control A4-A7 (6 pins), LED Connectors (16 pins)
NetP4_2: Reset (R4.1 SW1.1), USB Circuit (P4.2 U1.1)
NetPL00_1: LED Control A0-A3 (U5.18), LED Connectors (PL00.1)
NetPL00_2: LED Control A0-A3 (U5.17), LED Connectors (PL00.2)
NetPL00_3: LED Control A0-A3 (U5.16), LED Connectors (PL00.3)
NetPL01_1: LED Control A0-A3 (U5.15), LED Connectors (PL01.1)
NetPL01_2: LED Control A0-A3 (U5.14), LED Connectors (PL01.2)
NetPL01_3: LED Control A0-A3 (U5.13), LED Connectors (PL01.3)
NetPL02_1: LED Control A0-A3 (U5.12), LED Connectors (PL02.1)
NetPL02_2: LED Control A0-A3 (U5.11), LED Connectors (PL02.2)
NetPL02_3: LED Control A0-A3 (U7.18), LED Connectors (PL02.3)
NetPL03_1: LED Control A0-A3 (U7.16), LED Connectors (PL03.1)
NetPL03_2: LED Control A0-A3 (U7.17), LED Connectors (PL03.2)
NetPL03_3: LED Control A0-A3 (U7.15), LED Connectors (PL03.3)
NetPL04_1: LED Control A0-A3 (U7.14), LED Connectors (PL04.1)
NetPL04_2: LED Control A0-A3 (U7.13), LED Connectors (PL04.2)
NetPL04_3: LED Control A0-A3 (U7.12), LED Connectors (PL04.3)
NetPL05_1: LED Control A0-A3 (U7.11), LED Connectors (PL05.1)
NetPL05_2: LED Control A0-A3 (U9.18), LED Connectors (PL05.2)
NetPL05_3: LED Control A0-A3 (U9.17), LED Connectors (PL05.3)
NetPL06_1: LED Control A0-A3 (U9.16), LED Connectors (PL06.1)
NetPL06_2: LED Control A0-A3 (U9.15), LED Connectors (PL06.2)
NetPL06_3: LED Control A0-A3 (U9.14), LED Connectors (PL06.3)
NetPL07_1: LED Control A0-A3 (U9.13), LED Connectors (PL07.1)
NetPL07_2: LED Control A0-A3 (U9.12), LED Connectors (PL07.2)
NetPL07_3: LED Control A0-A3 (U9.11), LED Connectors (PL07.3)
NetPL08_1: LED Control A0-A3 (U11.18), LED Connectors (PL08.1)
NetPL08_2: LED Control A0-A3 (U11.17), LED Connectors (PL08.2)
NetPL08_3: LED Control A0-A3 (U11.16), LED Connectors (PL08.3)
NetPL09_1: LED Control A0-A3 (U11.15), LED Connectors (PL09.1)
NetPL09_2: LED Control A0-A3 (U11.14), LED Connectors (PL09.2)
NetPL09_3: LED Control A0-A3 (U11.13), LED Connectors (PL09.3)
NetPL10_1: LED Control A0-A3 (U11.12), LED Connectors (PL10.1)
NetPL10_2: LED Control A0-A3 (U11.11), LED Connectors (PL10.2)
NetPL10_3: LED Control A4-A7 (U13.18), LED Connectors (PL10.3)
NetPL11_1: LED Control A4-A7 (U13.16), LED Connectors (PL11.1)
NetPL11_2: LED Control A4-A7 (U13.17), LED Connectors (PL11.2)
NetPL11_3: LED Control A4-A7 (U13.15), LED Connectors (PL11.3)
NetPL12_1: LED Control A4-A7 (U13.14), LED Connectors (PL12.1)
NetPL12_2: LED Control A4-A7 (U13.13), LED Connectors (PL12.2)
NetPL12_3: LED Control A4-A7 (U13.12), LED Connectors (PL12.3)
NetPL13_1: LED Control A4-A7 (U13.11), LED Connectors (PL13.1)
NetPL13_2: LED Control A4-A7 (U15.18), LED Connectors (PL13.2)
NetPL13_3: LED Control A4-A7 (U15.17), LED Connectors (PL13.3)
NetPL14_1: LED Control A4-A7 (U15.16), LED Connectors (PL14.1)
NetPL14_2: LED Control A4-A7 (U15.15), LED Connectors (PL14.2)
NetPL14_3: LED Control A4-A7 (U15.14), LED Connectors (PL14.3)
NetPL15_1: LED Control A4-A7 (U15.13), LED Connectors (PL15.1)
NetPL15_2: LED Control A4-A7 (U15.12), LED Connectors (PL15.2)
NetPL15_3: LED Control A4-A7 (U15.11), LED Connectors (PL15.3)
NetU3_4: LED Circuit (U3.4), LED Control A0-A3 (U4.11)
NetU3_5: LED Circuit (U3.5), LED Control A0-A3 (U6.11)
NetU3_6: LED Circuit (U3.6), LED Control A0-A3 (U8.11)
NetU3_11: LED Circuit (U3.11), LED Control A0-A3 (U10.11)
NetU3_12: LED Circuit (U3.12), LED Control A4-A7 (U12.11)
NetU3_13: LED Circuit (U3.13), LED Control A4-A7 (U14.11)
NetU3_14: LED Circuit (U3.14), LED Control A0-A3 (U4.3 U6.3 U8.3 U10.3), LED Control A4-A7 (U12.3 U14.3)
NetU3_15: LED Circuit (U3.15), LED Control A0-A3 (U4.4 U6.4 U8.4 U10.4), LED Control A4-A7 (U12.4 U14.4)
NetU3_23: LED Circuit (U3.23), LED Control A0-A3 (U4.7 U6.7 U8.7 U10.7), LED Control A4-A7 (U12.7 U14.7)
NetU3_24: LED Circuit (U3.24), LED Control A0-A3 (U4.8 U6.8 U8.8 U10.8), LED Control A4-A7 (U12.8 U14.8)
NetU3_25: LED Circuit (U3.25), LED Control A0-A3 (U4.13 U6.13 U8.13 U10.13), LED Control A4-A7 (U12.13 U14.13)
NetU3_26: LED Circuit (U3.26), LED Control A0-A3 (U4.14 U6.14 U8.14 U10.14), LED Control A4-A7 (U12.14 U14.14)
NetU3_27: LED Circuit (U3.27), LED Control A0-A3 (U4.17 U6.17 U8.17 U10.17), LED Control A4-A7 (U12.17 U14.17)
NetU3_28: LED Circuit (U3.28), LED Control A0-A3 (U4.18 U6.18 U8.18 U10.18), LED Control A4-A7 (U12.18 U14.18)